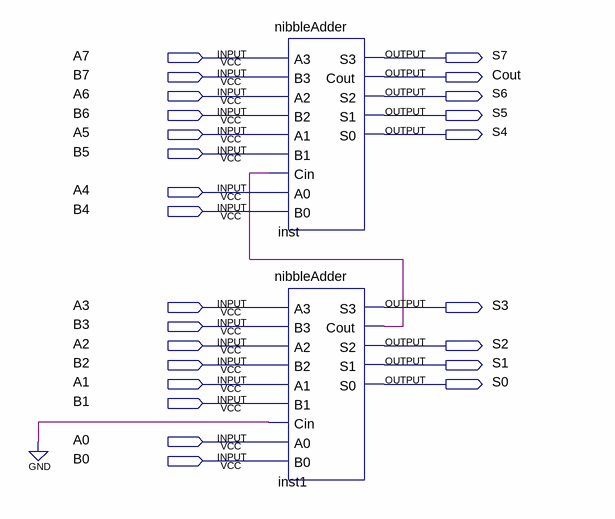
[diagram p0: schematic sheet]
// Quartus schematic byteAdder.bdf as structural Verilog: 2 symbols, 25 pins
module byteAdder (
  input  A7,
  input  B7,
  input  A6,
  input  B6,
  input  A5,
  input  B5,
  input  A4,
  input  B4,
  input  A3,
  input  B3,
  input  A2,
  input  B2,
  input  A1,
  input  B1,
  input  A0,
  input  B0,
  output S7,
  output Cout,
  output S6,
  output S5,
  output S4,
  output S3,
  output S2,
  output S1,
  output S0
);

  wire inst1_cout;

  nibbleAdder inst (
    .A3(A7), .B3(B7), .A2(A6), .B2(B6), .A1(A5), .B1(B5), .Cin(inst1_cout), .A0(A4), .B0(B4), .S3(S7),
    .Cout(Cout), .S2(S6), .S1(S5), .S0(S4));
  nibbleAdder inst1 (
    .A3(A3), .B3(B3), .A2(A2), .B2(B2), .A1(A1), .B1(B1), .Cin(1'b0), .A0(A0), .B0(B0), .S3(S3),
    .Cout(inst1_cout), .S2(S2), .S1(S1), .S0(S0));
endmodule
